# EAGLE design MLX90393_Magnetometer_Breakout (EAGLE 7.6.0)
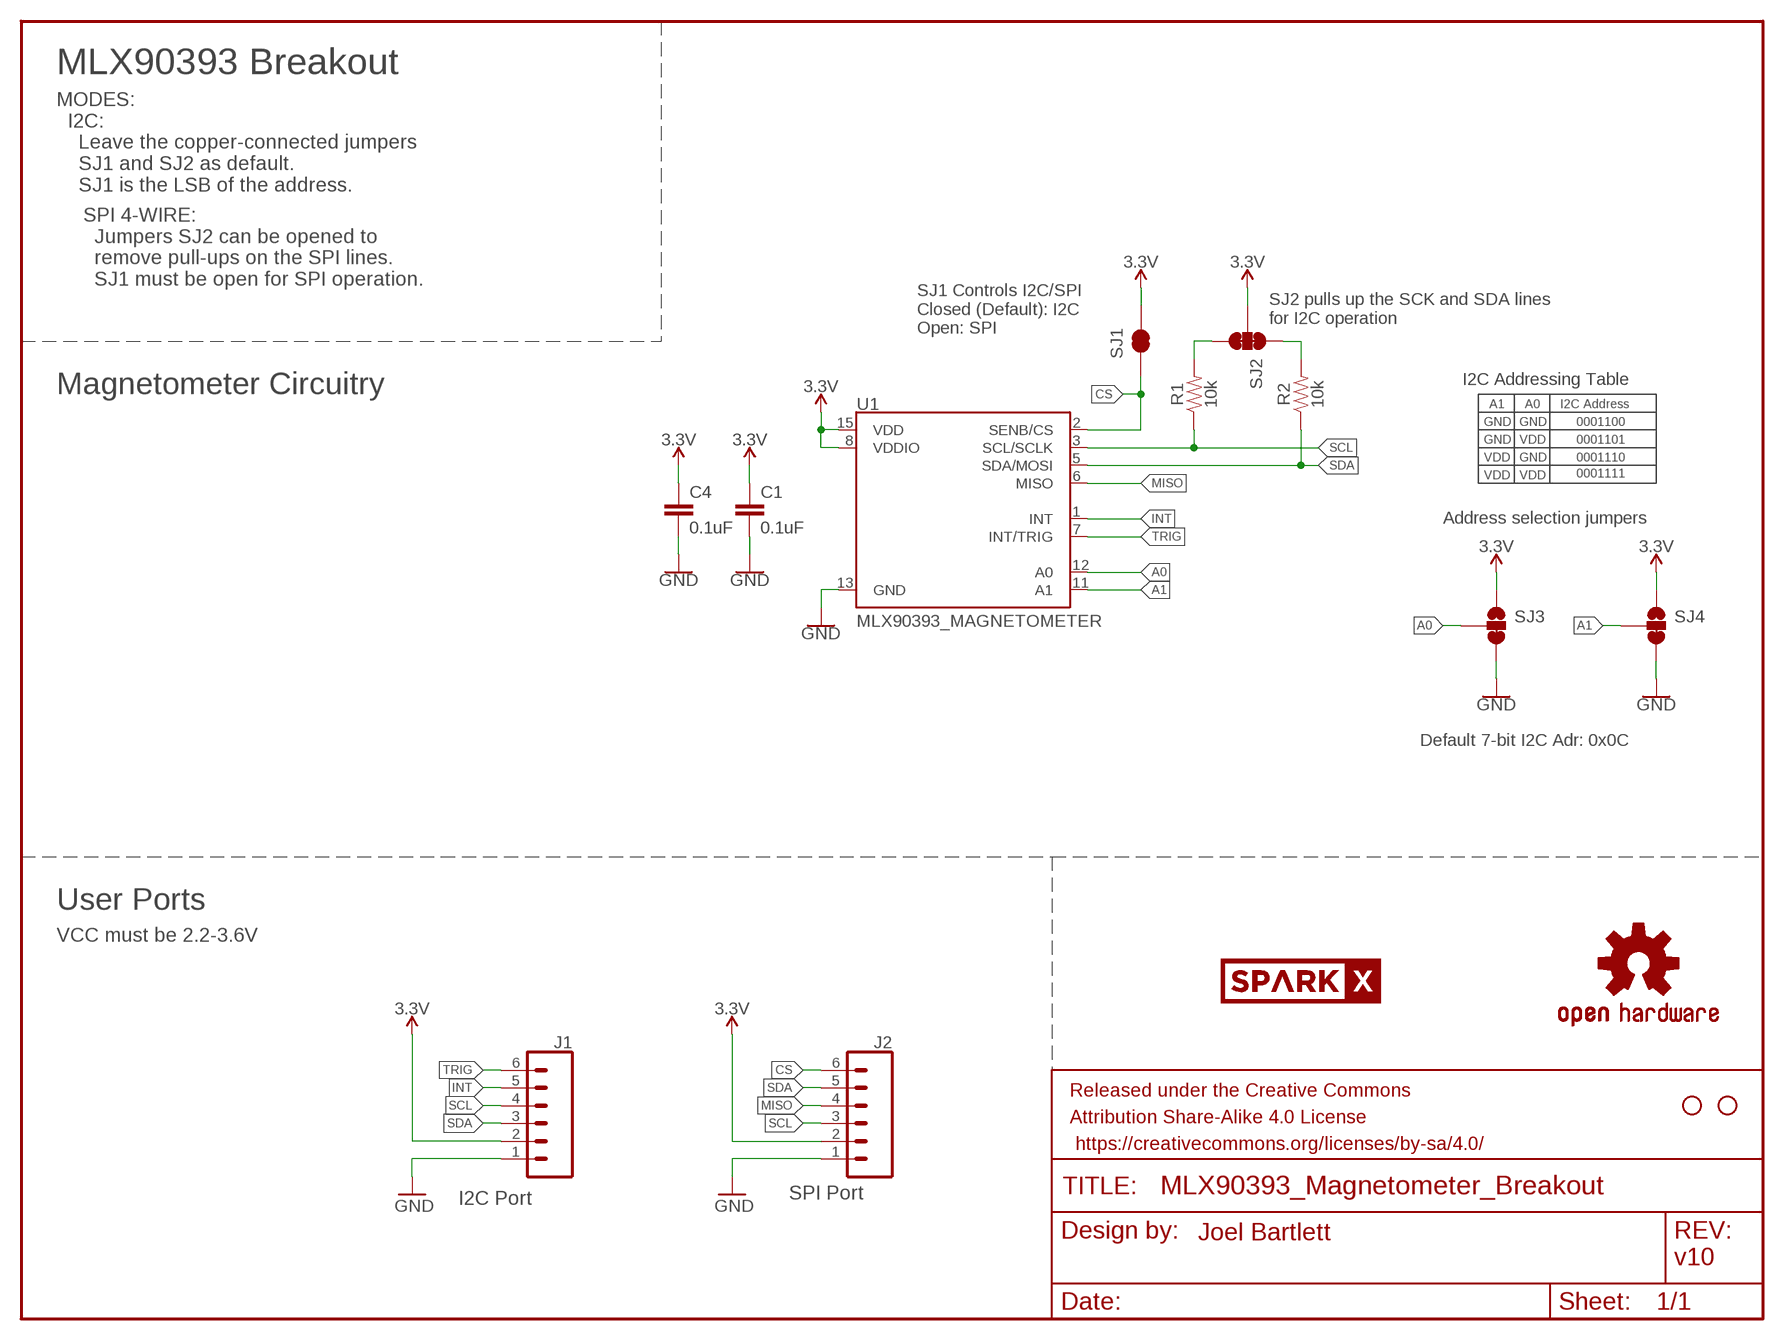
[diagram p0: schematic, sheet 1]

## Parts
C1  0.1uF  0.1UF-0603-25V-(+80/-20%)  [0603]
C4  0.1uF  0.1UF-0603-25V-(+80/-20%)  [0603]
FRAME2  FRAME-LETTER  [CREATIVE_COMMONS]
J1  CONN_06NO_SILK_FEMALE_PTH  [1X06_NO_SILK]
J2  CONN_06NO_SILK_FEMALE_PTH  [1X06_NO_SILK]
JP3  STAND-OFF  [STAND-OFF]
JP4  STAND-OFF  [STAND-OFF]
R1  10k  10KOHM-0603-1/10W-1%  [0603]
R2  10k  10KOHM-0603-1/10W-1%  [0603]
SJ1  JUMPER-SMT_2_NC_TRACE_SILK  [SMT-JUMPER_2_NC_TRACE_SILK]
SJ2  JUMPER-PAD-3-NC_BY_TRACE  [PAD-JUMPER-3-3OF3_NC_BY_TRACE_YES_SILK_FULL_BOX]
SJ3  JUMPER-SMT_3_1-NC_TRACE_SILK  [SMT-JUMPER_3_1-NC_TRACE_SILK]
SJ4  JUMPER-SMT_3_1-NC_TRACE_SILK  [SMT-JUMPER_3_1-NC_TRACE_SILK]
U1  MLX90393_MAGNETOMETER  [QFN-16]
U$1  OSHW-LOGOS  [OSHW-LOGO-S]
U$2  SPARKX-LOGO2  [SPARKX-TINY]

## Nets
3.3V: C1.1 C4.1 J1.2 J2.2 SJ1.2 SJ2.2 SJ3.1 SJ4.1 U1.8(VDDIO) U1.15(VDD)
A0: SJ3.2 U1.12(A0)
A1: SJ4.2 U1.11(A1)
CS: J2.6 SJ1.1 U1.2(SENB/CS)
GND: C1.2 C4.2 J1.1 J2.1 SJ3.3 SJ4.3 U1.13(GND)
INT: J1.5 U1.1(INT)
MISO: J2.4 U1.6(MISO)
N$4: R2.2 SJ2.1
N$5: R1.2 SJ2.3
SCL: J1.4 J2.3 R1.1 U1.3(SCL/SCLK)
SDA: J1.3 J2.5 R2.1 U1.5(SDA/MOSI)
TRIG: J1.6 U1.7(INT/TRIG)

## Notes on the sheet
- MLX90393 Breakout
- MODES:
    I2C:
      Leave the copper-connected jumpers
      SJ1 and SJ2 as default.
      SJ1 is the LSB of the address.
- SPI 4-WIRE:
    Jumpers SJ2 can be opened to 
    remove pull-ups on the SPI lines.
    SJ1 must be open for SPI operation.
- SJ2 pulls up the SCK and SDA lines
  for I2C operation
- SJ1 Controls I2C/SPI
  Closed (Default): I2C
  Open: SPI
- I2C Addressing Table
- Magnetometer Circuitry
- A1 | A0 | I2C Address
- GND | GND | 0001100
- GND | VDD | 0001101
- VDD | GND | 0001110
- VDD | VDD | 0001111
- Address selection jumpers
- Default 7-bit I2C Adr: 0x0C
- User Ports
- VCC must be 2.2-3.6V
- I2C Port | SPI Port
- Joel Bartlett
- v10

## Library data of the parts
C1 C4 = SparkFun-Capacitors:0.1UF: 0.1µF ceramic capacitors A capacitor is a passive two-terminal electrical component used to store electrical energy temporarily in an electric field.; PROD_ID: CAP-00810
FRAME2 = SparkFun-Aesthetics:FRAME-LETTER: Schematic Frame Standard 8.5x11 US Letter frame
J1 J2 = SparkFun-Connectors:CONN_06: Header 6 Standard 6-pin 0.1" header. Use with straight break away headers (SKU : PRT-00116), right angle break away headers (PRT-00553), swiss pins (PRT-00743), machine pins (PRT-00117), and female headers (PRT-00115). Molex polarized connector foot print use with SKU : PRT-08094 with associated crimp pins and housings. NOTES ON THE VARIANTS LOCK and LOCK_LONGPADS... This footprint was designed to help hold the alignment of a through-hole component (i.e. 6-pin header) while soldering it into place. You may notice that each hole has been shifted either up or down by 0.005 of an inch from it's more standard position (which is a perfectly straight line). This slight alteration caused the pins (the squares in the middle) to touch the edges of the holes. Because they are alternating, it causes a "brace" to hold the component in place. 0.005 has proven to be the perfect amount of "off-center" position when using our standard breakaway headers. Although looks a little odd when you look at the bare footprint, once you have a header in there, the alteration is very hard to notice. Also,if you push a header all the way into place, it is covered up entirely on the bottom side. This idea of altering the position of holes to aid alignment will be further integrated into the Sparkfun Library for other footprints. It can help hold any component with 3 or more connection pins.; PROD_ID: CONN-08437
JP3 JP4 = SparkFun:STAND-OFF: Stand Off This is the mechanical footprint for a #4 phillips button head screw. Use the keepout ring to avoid running the screw head into surrounding components. SKU : PRT-00447
R1 R2 = SparkFun-Resistors:10KOHM: 10kΩ resistor A resistor is a passive two-terminal electrical component that implements electrical resistance as a circuit element. Resistors act to reduce current flow, and, at the same time, act to lower voltage levels within circuits.; PROD_ID: RES-00824
SJ1 = SparkFun-Jumpers:JUMPER-SMT_2_NC_TRACE: Normally closed trace jumper This jumper has a trace between two pads so it's normally closed (NC). Use a razor knife to open the connection. For best results follow the IPC guidelines for cutting traces: Cutout at least 0.063 mm (0.005 in). Remove all loose material to clean up the cut area. Seal the cut with an approved epoxy. Reapply solder to reclose the connection.
SJ2 = TestAperatures:JUMPER-PAD-3-NC_BY_TRACE
SJ3 SJ4 = SparkFun-Jumpers:JUMPER-SMT_3_1-NC_TRACE: Normally closed trace jumper (1 of 2 connections) This jumper has a trace between two pads so it's normally closed (NC). The other connection is normally open (NO). Use a razor knife to open the connection. For best results follow the IPC guidelines for cutting traces: Cutout at least 0.063 mm (0.005 in). Remove all loose material to clean up the cut area. Seal the cut with an approved epoxy. Reapply solder to reclose the connection, or to close the NO connection.
U1 = SparkX:MLX90393_MAGNETOMETER
U$1 = SparkFun:OSHW-LOGO: Open Source Hardware Logo This logo indicates the piece of hardware it is found on incorporates a OSHW license and/or adheres to the definition of open source hardware found here: http://freedomdefined.org/OSHW
U$2 = SparkX:SPARKX-LOGO

## Board
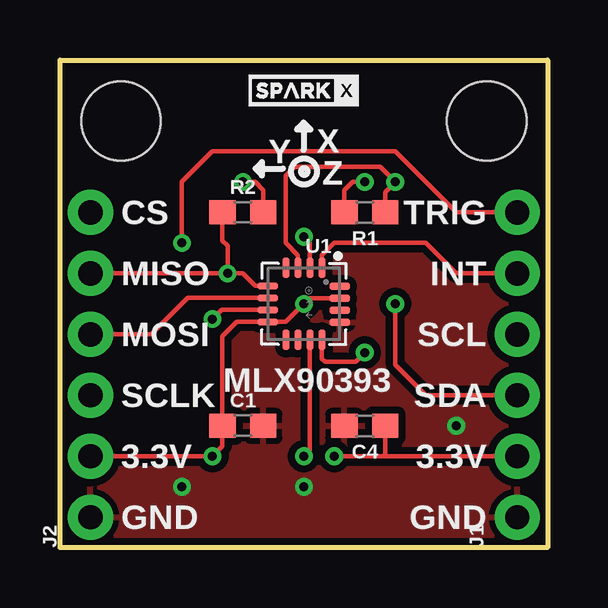
[diagram p1: board, top side]
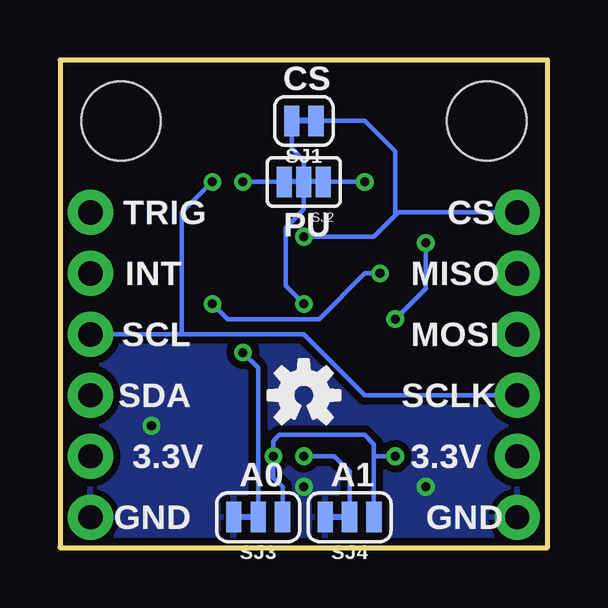
[diagram p2: board, bottom side, seen from below]

Size 20.32 x 20.32 mm. Coordinates in mm from the lower left corner, seen from the top.
Outline: 20.32,0 0,0 0,20.32 20.32,20.32 20.32,0
Copper layers (1*16): Top 0.035mm / dielectric 1.5mm / Bottom 0.035mm
Design rules "SparkFun-2-layer-TIGHT": minimum track width 7mil, minimum drill 15mil, track to track 7mil, track to pad 7mil, pad to pad 7mil, via to via 7mil, smd to smd 7mil, copper to edge 7mil, drill to drill 7mil, minimum pad ring 7mil, minimum via ring 7mil, stop-mask expansion 4mil, vias tented up to drill 25mil, thermal gap 10mil

### Footprints (pad centres in the part's own frame; a part is rotated, then mirrored left to right if it is on the bottom)
0603 = smd 1.1 x 1: 1 -0.85,0; 2 0.85,0
1X06_NO_SILK = drill 1.016 pad 1.88: 1 0,0; 2 2.54,0; 3 5.08,0; 4 7.62,0; 5 10.16,0; 6 12.7,0
STAND-OFF = hole 3.302: 0,0
SMT-JUMPER_2_NC_TRACE_SILK = smd 0.635 x 1.27: 1 -0.508,0; 2 0.508,0
PAD-JUMPER-3-3OF3_NC_BY_TRACE_YES_SILK_FULL_BOX = smd 0.635 x 1.27: 1 -0.813,0; 2 0,0; 3 0.813,0
SMT-JUMPER_3_1-NC_TRACE_SILK = smd 0.635 x 1.27: 1 -1.016,0; 2 0,0; 3 1.016,0
QFN-16 = smd 0.3 x 0.85: 1 0.754,1.498; 2 0.254,1.498; 3 -0.246,1.498; 4 -0.746,1.498; 9 -0.746,-1.506; 10 -0.246,-1.506; 11 0.254,-1.506; 12 0.754,-1.506 | smd 0.85 x 0.3: 5 -1.508,0.746; 6 -1.508,0.246; 7 -1.508,-0.254; 8 -1.508,-0.754; 13 1.496,-0.764; 14 1.496,-0.264; 15 1.496,0.236; 16 1.496,0.736

### Placement (x,y rotation side)
C1  7.62,5.08 0 top
C4  12.7,5.08 180 top
FRAME2  -20.95,-10.16 0 top  (outside the outline)
J1  19.05,1.27 90 top
J2  1.27,1.27 90 top
JP3  2.54,17.78 0 top
JP4  17.78,17.78 0 top
R1  12.7,13.97 180 top
R2  7.62,13.97 0 top
SJ1  10.16,17.78 180 bottom
SJ2  10.16,15.24 180 bottom
SJ3  12.06,1.27 180 bottom
SJ4  8.26,1.27 180 bottom
U1  10.16,10.16 0 top
U$1  10.16,6.35 0 bottom
U$2  10.16,19.05 0 top

### Tracks (layer width: path | path; a pad name or v marks a point on that pad's centre or on a via)
3.3V  (via drill 0.38)
  Top 0.178: U1.15 10.4,10.4 v10.16,10.16 9.41,9.41 U1.8 7.37,9.41 6.77,8.8 C1.1 6.77,4.23 v6.35,3.81 J2.2 | v11.43,3.81 13.46,3.81 | 13.46,3.81 J1.2 | C4.1 13.55,3.9 13.46,3.81
  Bottom 0.178: SJ1.2 10.67,16.64 10.16,16.13 SJ2.2 10.16,14.1 10.92,13.34 10.92,10.92 v10.16,10.16 | SJ4.1 7.24,3.81 | 7.24,3.81 7.24,4.32 7.62,4.7 11.18,4.7 11.43,4.45 v11.43,3.81 11.43,2.92 11.05,2.54 SJ3.1 | v6.35,3.81 7.24,3.81
A0  (via drill 0.38)
  Top 0.178: U1.12 10.91,7.88 11.05,7.75 12.32,7.75 v12.7,8.13
  Bottom 0.178: SJ3.2 12.06,7.49 v12.7,8.13
A1  (via drill 0.38)
  Top 0.178: U1.11 10.41,4.06 v10.16,3.81
  Bottom 0.178: v10.16,3.81 8.89,3.81 8.26,3.17 SJ4.2
CS  (via drill 0.38)
  Top 0.178: U1.2 10.41,12.7 v10.16,12.95
  Bottom 0.178: SJ1.1 7.62,17.78 6.35,16.51 6.35,13.84 | v10.16,12.95 7.24,12.95 6.35,13.84 | J2.6 6.22,13.97 6.35,13.84
GND  (via drill 0.38)
  other vias: 5.08,2.54 10.16,2.54 16.51,5.08
  pour Top (isolate 0.305): 0,20.32 0,0 20.32,0 20.32,20.32
  pour Bottom (isolate 0.305): 0,20.32 0,0 20.32,0 20.32,20.32
INT
  Top 0.178: U1.1 10.91,12.18 11.43,12.7 15.24,12.7 16.51,11.43 J1.5
MISO
  Top 0.178: U1.6 5.33,10.41 3.81,8.89 J2.4
N$4  (via drill 0.38)
  Top 0.178: R2.2 8.47,14.9 8.13,15.24 v7.62,15.24
  Bottom 0.178: SJ2.1 v7.62,15.24
N$5  (via drill 0.38)
  Top 0.178: R1.2 11.85,14.9 12.19,15.24 v12.7,15.24
  Bottom 0.178: SJ2.3 v12.7,15.24
SCL  (via drill 0.38)
  Top 0.178: R1.1 13.55,14.82 v13.97,15.24 13.34,15.88 9.78,15.88 9.4,15.49 9.4,12.7 9.91,12.18 U1.3
  Bottom 0.178: J2.3 7.62,6.35 10.16,8.89 15.24,8.89 | 15.24,8.89 J1.4 | v13.97,15.24 15.24,13.97 15.24,8.89
SDA  (via drill 0.38)
  Top 0.178: U1.5 8.14,10.91 7.62,11.43 v6.99,11.43 | J1.3 15.24,6.35 13.97,7.62 v13.97,10.16 | R2.1 6.77,12.79 6.99,12.57 v6.99,11.43 | v6.99,11.43 J2.5
  Bottom 0.178: v13.97,10.16 13.34,9.53 9.53,9.53 7.62,11.43 v6.99,11.43
TRIG  (via drill 0.38)
  Top 0.178: U1.7 6.73,9.91 v6.35,9.53 | J1.6 16.51,13.97 13.97,16.51 6.35,16.51 5.08,15.24 v5.08,12.7
  Bottom 0.178: v5.08,12.7 5.08,10.79 v6.35,9.53

### Text on the board
tPlace: Y | X | Z | CS | TRIG | MISO | INT | MOSI | SCL | MLX90393 | SCLK | SDA | 3.3V | 3.3V | GND | GND
bPlace: CS | CS | PU | TRIG | MISO | INT | MOSI | SCL | SCLK | SDA | 3.3V | A1 | A0 | 3.3V | GND | GND
tDocu: J. Bartlett